# EAGLE design PIC 16F877A Board_V4 (SMD) (EAGLE 9.6.2)
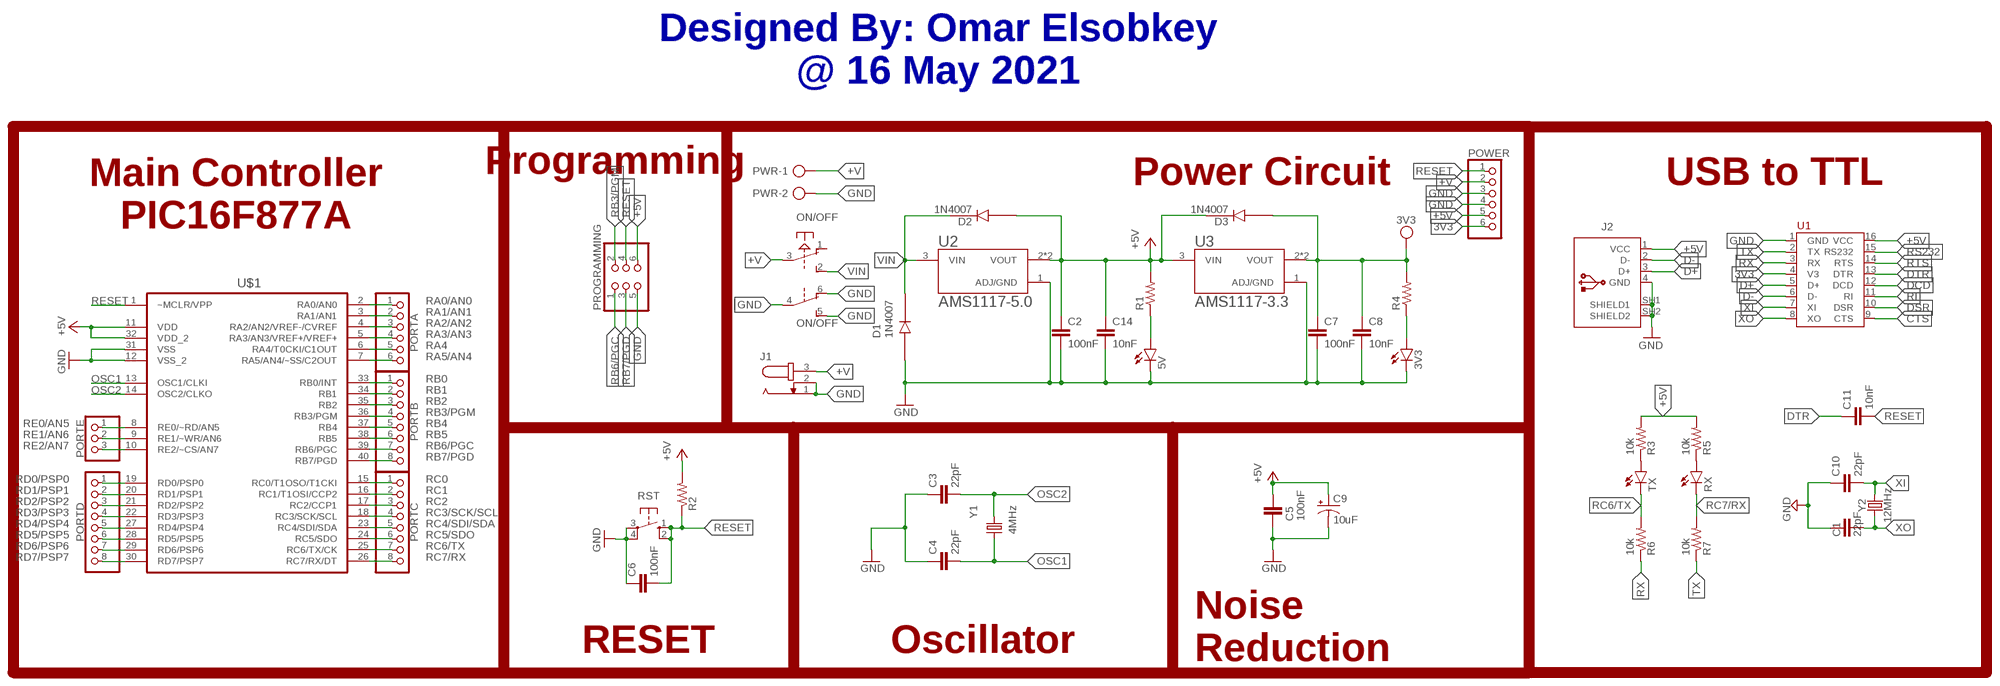
[diagram p0: schematic, sheet 1]

## Parts
3V3  LEDSML0805  [SML0805]
5V  LEDSML0805  [SML0805]
C1  22pF  C_CHIP-0805(2012-METRIC)  [CAPC2012X110]
C2  100nF  C_CHIP-0805(2012-METRIC)  [CAPC2012X110]
C3  22pF  C_CHIP-0805(2012-METRIC)  [CAPC2012X110]
C4  22pF  C_CHIP-0805(2012-METRIC)  [CAPC2012X110]
C5  100nF  C_CHIP-0805(2012-METRIC)  [CAPC2012X110]
C6  100nF  C_CHIP-0805(2012-METRIC)  [CAPC2012X110]
C7  100nF  C_CHIP-0805(2012-METRIC)  [CAPC2012X110]
C8  10nF  C_CHIP-0805(2012-METRIC)  [CAPC2012X110]
C9  10uF  10UF-POLAR-RADIAL-2.5MM-KIT-25V-20%  [CPOL-RADIAL-2.5MM-5MM-KIT]
C10  22pF  C_CHIP-0805(2012-METRIC)  [CAPC2012X110]
C11  10nF  C_CHIP-0805(2012-METRIC)  [CAPC2012X110]
C14  10nF  C_CHIP-0805(2012-METRIC)  [CAPC2012X110]
D1  1N4007  DIODE_SMD  [SMA/DO-214AC]
D2  1N4007  DIODE_SMD  [SMA/DO-214AC]
D3  1N4007  DIODE_SMD  [SMA/DO-214AC]
J1  JACK-PLUG0  [SPC4077]
J2  61729-1011  [61729-1011BLF]
ON/OFF  PVA2R  [PVA2R]
PORTA  PINHD-1X6  [1X06]
PORTB  PINHD-1X8  [1X08]
PORTC  PINHD-1X8  [1X08]
PORTD  PINHD-1X8  [1X08]
PORTE  PINHD-1X3  [1X03]
POWER  PINHD-1X6  [1X06]
PROGRAMMING  PINHD-2X3  [2X03]
PWR  AK500/2-H  [AK500/2-H]
R1  RESISTOR1206  [1206]
R2  RESISTOR1206  [1206]
R3  10k  RESISTOR1206  [1206]
R4  RESISTOR1206  [1206]
R5  10k  RESISTOR1206  [1206]
R6  10k  RESISTOR1206  [1206]
R7  10k  RESISTOR1206  [1206]
RST  10-XX  [B3F-10XX]
RX  LEDSML0805  [SML0805]
TX  LEDSML0805  [SML0805]
U1  CH340G  [SOP-16]
U2  AMS1117-5.0  [AMS1117-5.0]
U3  AMS1117-3.3  AMS1117-5.0  [AMS1117-5.0]
U$1  PIC16F877A-I/P  [PDIP-40]
Y1  4MHz  CRYSTALPTH-HC49UV  [HC49U]
Y2  12MHz  CRYSTALPTH-HC49UV  [HC49U]

## Nets
3V3: C7.1 C8.1 D3.2(A) POWER.6 R4.2 U1.4(V3) U3.2(VOUT) U3.4(VOUT)
+5V: C2.1 C5.2 C9.1(+) C14.1 D2.2(A) D3.1(C) J2.1(VCC) POWER.5 PROGRAMMING.6 R1.2 R2.2 R3.2 R5.2 U1.16(VCC) U2.2(VOUT) U2.4(VOUT) U3.3(VIN) U$1.11(VDD) U$1.32(VDD_2)
+V: J1.3 ON/OFF.3(1:P) POWER.2 PWR.1
CTS: U1.9(CTS)
D+: J2.3(D+) U1.5(D+)
D-: J2.2(D-) U1.6(D-)
DCD: U1.12(DCD)
DSR: U1.10(DSR)
DTR: C11.1 U1.13(DTR)
GND: 3V3.C 5V.C C1.1 C2.2 C3.1 C4.1 C5.1 C6.1 C7.2 C8.2 C9.2(-) C10.1 C14.2 D1.2(A) J1.1 J1.2 J2.4(GND) J2.SH1(SHIELD1) J2.SH2(SHIELD2) ON/OFF.4(2:P) ON/OFF.5(2:S) ON/OFF.6(2:O) POWER.3 POWER.4 PROGRAMMING.5 PWR.2 RST.3(P) RST.4(P1) U1.1(GND) U2.1(ADJ/GND) U3.1(ADJ/GND) U$1.12(VSS_2) U$1.31(VSS)
N$1: 3V3.A R4.1
N$2: R3.1 TX.A
N$3: R5.1 RX.A
N$4: 5V.A R1.1
OSC1: C4.2 U$1.13(OSC1/CLKI) Y1.2
OSC2: C3.2 U$1.14(OSC2/CLKO) Y1.1
RA0/AN0: PORTA.1 U$1.2(RA0/AN0)
RA1/AN1: PORTA.2 U$1.3(RA1/AN1)
RA2/AN2: PORTA.3 U$1.4(RA2/AN2/VREF-/CVREF)
RA3/AN3: PORTA.4 U$1.5(RA3/AN3/VREF+/VREF+)
RA4: PORTA.5 U$1.6(RA4/T0CKI/C1OUT)
RA5/AN4: PORTA.6 U$1.7(RA5/AN4/~SS/C2OUT)
RB0: PORTB.1 U$1.33(RB0/INT)
RB1: PORTB.2 U$1.34(RB1)
RB2: PORTB.3 U$1.35(RB2)
RB3/PGM: PORTB.4 PROGRAMMING.2 U$1.36(RB3/PGM)
RB4: PORTB.5 U$1.37(RB4)
RB5: PORTB.6 U$1.38(RB5)
RB6/PGC: PORTB.7 PROGRAMMING.1 U$1.39(RB6/PGC)
RB7/PGD: PORTB.8 PROGRAMMING.3 U$1.40(RB7/PGD)
RC0: PORTC.1 U$1.15(RC0/T1OSO/T1CKI)
RC1: PORTC.2 U$1.16(RC1/T1OSI/CCP2)
RC2: PORTC.3 U$1.17(RC2/CCP1)
RC3/SCK/SCL: PORTC.4 U$1.18(RC3/SCK/SCL)
RC4/SDI/SDA: PORTC.5 U$1.23(RC4/SDI/SDA)
RC5/SDO: PORTC.6 U$1.24(RC5/SDO)
RC6/TX: PORTC.7 R6.2 TX.C U$1.25(RC6/TX/CK)
RC7/RX: PORTC.8 R7.2 RX.C U$1.26(RC7/RX/DT)
RD0/PSP0: PORTD.1 U$1.19(RD0/PSP0)
RD1/PSP1: PORTD.2 U$1.20(RD1/PSP1)
RD2/PSP2: PORTD.3 U$1.21(RD2/PSP2)
RD3/PSP3: PORTD.4 U$1.22(RD3/PSP3)
RD4/PSP4: PORTD.5 U$1.27(RD4/PSP4)
RD5/PSP5: PORTD.6 U$1.28(RD5/PSP5)
RD6/PSP6: PORTD.7 U$1.29(RD6/PSP6)
RD7/PSP7: PORTD.8 U$1.30(RD7/PSP7)
RE0/AN5: PORTE.1 U$1.8(RE0/~RD/AN5)
RE1/AN6: PORTE.2 U$1.9(RE1/~WR/AN6)
RE2/AN7: PORTE.3 U$1.10(RE2/~CS/AN7)
RESET: C6.2 C11.2 POWER.1 PROGRAMMING.4 R2.1 RST.1(S) RST.2(S1) U$1.1(~MCLR/VPP)
RI: U1.11(RI)
RS232: U1.15(RS232)
RTS: U1.14(RTS)
RX: R6.1 U1.3(RX)
TX: R7.1 U1.2(TX)
VIN: D1.1(C) D2.1(C) ON/OFF.2(1:S) U2.3(VIN)
XI: C10.2 U1.7(XI) Y2.2
XO: C1.2 U1.8(XO) Y2.1
Unconnected: ON/OFF.1(1:O)

## Notes on the sheet
- Designed By: Omar Elsobkey
  @ 16 May 2021
- Programming | Power Circuit | USB to TTL
- Main Controller
  PIC16F877A
- RESET | Oscillator
- Noise
  Reduction

## Library data of the parts
3V3 5V RX TX = led:LED: LED OSRAM: - CHIPLED LG R971, LG N971, LY N971, LG Q971, LY Q971, LO R971, LY R971 LH N974, LH R974 LS Q976, LO Q976, LY Q976 LO Q996 - Hyper CHIPLED LW Q18S LB Q993, LB Q99A, LB R99A - SideLED LS A670, LO A670, LY A670, LG A670, LP A670 LB A673, LV A673, LT A673, LW A673 LH A674 LY A675 LS A676, LA A676, LO A676, LY A676, LW A676 LS A679, LY A679, LG A679 - Hyper Micro SIDELED® LS Y876, LA Y876, LO Y876, LY Y876 LT Y87S - SmartLED LW L88C, LW L88S LB L89C, LB L89S, LG L890 LS L89K, LO L89K, LY L89K LS L896, LA L896, LO L896, LY L896 - TOPLED LS T670, LO T670, LY T670, LG T670, LP T670 LSG T670, LSP T670, LSY T670, LOP T670, LYG T670 LG T671, LOG T671, LSG T671 LB T673, LV T673, LT T673, LW T673 LH T674 LS T676, LA T676, LO T676, LY T676, LB T676, LH T676, LSB T676, LW T676 LB T67C, LV T67C, LT T67C, LS T67K, LO T67K, LY T67K, LW E67C LS E67B, LA E67B, LO E67B, LY E67B, LB E67C, LV E67C, LT E67C LW T67C LS T679, LY T679, LG T679 LS T770, LO T770, LY T770, LG T770, LP T770 LB T773, LV T773, LT T773, LW T773 LH T774 LS E675, LA E675, LY E675, LS T675 LS T776, LA T776, LO T776, LY T776, LB T776 LHGB T686 LT T68C, LB T68C - Hyper Mini TOPLED® LB M676 - Mini TOPLED Santana® LG M470 LS M47K, LO M47K, LY M47K Source: http://www.osram.convergy.de LUXEON: - LUMILED® LXK2-PW12-R00, LXK2-PW12-S00, LXK2-PW14-U00, LXK2-PW14-V00 LXK2-PM12-R00, LXK2-PM12-S00, LXK2-PM14-U00 LXK2-PE12-Q00, LXK2-PE12-R00, LXK2-PE12-S00, LXK2-PE14-T00, LXK2-PE14-U00 LXK2-PB12-K00, LXK2-PB12-L00, LXK2-PB12-M00, LXK2-PB14-N00, LXK2-PB14-P00, LXK2-PB14-Q00 LXK2-PR12-L00, LXK2-PR12-M00, LXK2-PR14-Q00, LXK2-PR14-R00 LXK2-PD12-Q00, LXK2-PD12-R00, LXK2-PD12-S00 LXK2-PH12-R00, LXK2-PH12-S00 LXK2-PL12-P00, LXK2-PL12-Q00, LXK2-PL12-R00 Source: www.luxeon.com KINGBRIGHT: KA-3528ASYC Source: www.kingbright.com
C1-C8 C10 C11 C14 = Capacitor:C: Capacitor - Generic; CATEGORY: Capacitor
C9 = SparkFun-Capacitors:10UF-POLAR: 10.0µF polarized capacitors A capacitor is a passive two-terminal electrical component used to store electrical energy temporarily in an electric field.; PROD_ID: CAP-08440
D1-D3 = Diode SMD:DIODE_SMD: Rectifier Diode Switching 50V 1A 2-Pin DO-214AC T/R Rectifier Diode Switching 50V 1A 2-Pin DO-214AC T/R Check prices <https://pricing.snapeda.com/parts/S1A/NKK%20Switches/view-part?ref=eda>; AVAILABILITY: In Stock; DESCRIPTION: SMD Diodo Rectificador 1A 50V S1A SMD DO-214AC/SMA DIOTEC; MF: NKK Switches; MP: S1A; PACKAGE: DO-214 Diotec; PRICE: None
J1 = con-jack:JACK-PLUG: DC POWER JACK Power Jack, DC, Right Angle, Through Hole, Rated 5A at 16VDC, PC Terminals Distributor: Farnell (www.Farnell.de) Drawing: 84N1161.pdf / 84N1162.pdf Manufacturer: SPC Technology (www.spctechnology.com) Type: SPC4077 / SPC 4078; OC_FARNELL: unknown; OC_NEWARK: unknown
J2 = Connector_USB:61729-1011: USB(2.0) Type-B, RCPT, 4POS, THT-R/A Datasheet <https://www.amphenol-icc.com/media/wysiwyg/files/drawing/61729.pdf>; CATEGORY: Connector; CONTACTS: 4; CURRENT_RATING: 1A; DESCRIPTION: CONN RCPT USB2.0 TYPEB 4POS R/A; GENDER: Receptacle; MANUFACTURER: Amphenol ICC (FCI); MOUNT_TYPE: R/A; MPN: 61729-1011BLF; OPERATING_TEMP: -55°C to 85°C; PART_STATUS: Active; ROHS_COMPLIANT: RoHS Compliant; SERIES: 61729; SUB-CATEGORY: USB; TYPE: USB-B
ON/OFF = switch-misc:PVA2R: ITT SWITCH
PORTA POWER = pinhead:PINHD-1X6: PIN HEADER
PORTB PORTC PORTD = pinhead:PINHD-1X8: PIN HEADER
PORTE = pinhead:PINHD-1X3: PIN HEADER
PROGRAMMING = pinhead:PINHD-2X3: PIN HEADER
PWR = con-ptr500:AK500/2-H: CONNECTOR Aug. 2004 / PTR Meßtechnik: Die Bezeichnung der Serie AK505 wurde geändert. Es handelt sich hierbei um AK500 in horizontaler Ausführung.; OC_FARNELL: unknown; OC_NEWARK: unknown
R1-R7 = SparkFun-Resistors:RESISTOR: Generic Resistor Package
RST = switch-omron:10-XX: OMRON SWITCH; MPN: B3F-1000; OC_FARNELL: 176432; OC_NEWARK: 36M3542
U1 = CH340G:CH340G
U2 U3 = AMS1117-5.0:AMS1117-5.0: Sot223/Pkg 1-Amp 5-Volt Low Drop Out Voltage Regulatator; AVAILABILITY: Unavailable; DESCRIPTION: Sot223/Pkg 1-Amp 5-Volt Low Drop Out Voltage Regulatator; MF: Advanced Monolithic Systems; MP: AMS1117-5.0; PACKAGE: None; PRICE: None
U$1 = PIC:PIC16F877A-I/P: 8-Bit CMOS FLASH Microcontrollers Check prices <https://pricing.snapeda.com/parts/PIC16F877A-I/P/Microchip/view-part?ref=eda>; AVAILABILITY: Good; DESCRIPTION: PIC PIC® 16F Microcontroller IC 8-Bit 20MHz 14KB (8K x 14) FLASH 44-TQFP (10x10); MF: Microchip; MP: PIC16F877A-I/P; PACKAGE: DIP-40 Microchip; PRICE: None; PURCHASE-URL: https://pricing.snapeda.com/search/part/PIC16F877A-I/P/?ref=eda
Y1 Y2 = SparkFun-Clocks:CRYSTAL: Crystals (Generic) These are passive quartz crystals, which can be used as a clock source for a microcontroller. Crystal's are two-terminal devices. They require external "load" capacitors to generate an oscillating signal.

## Board
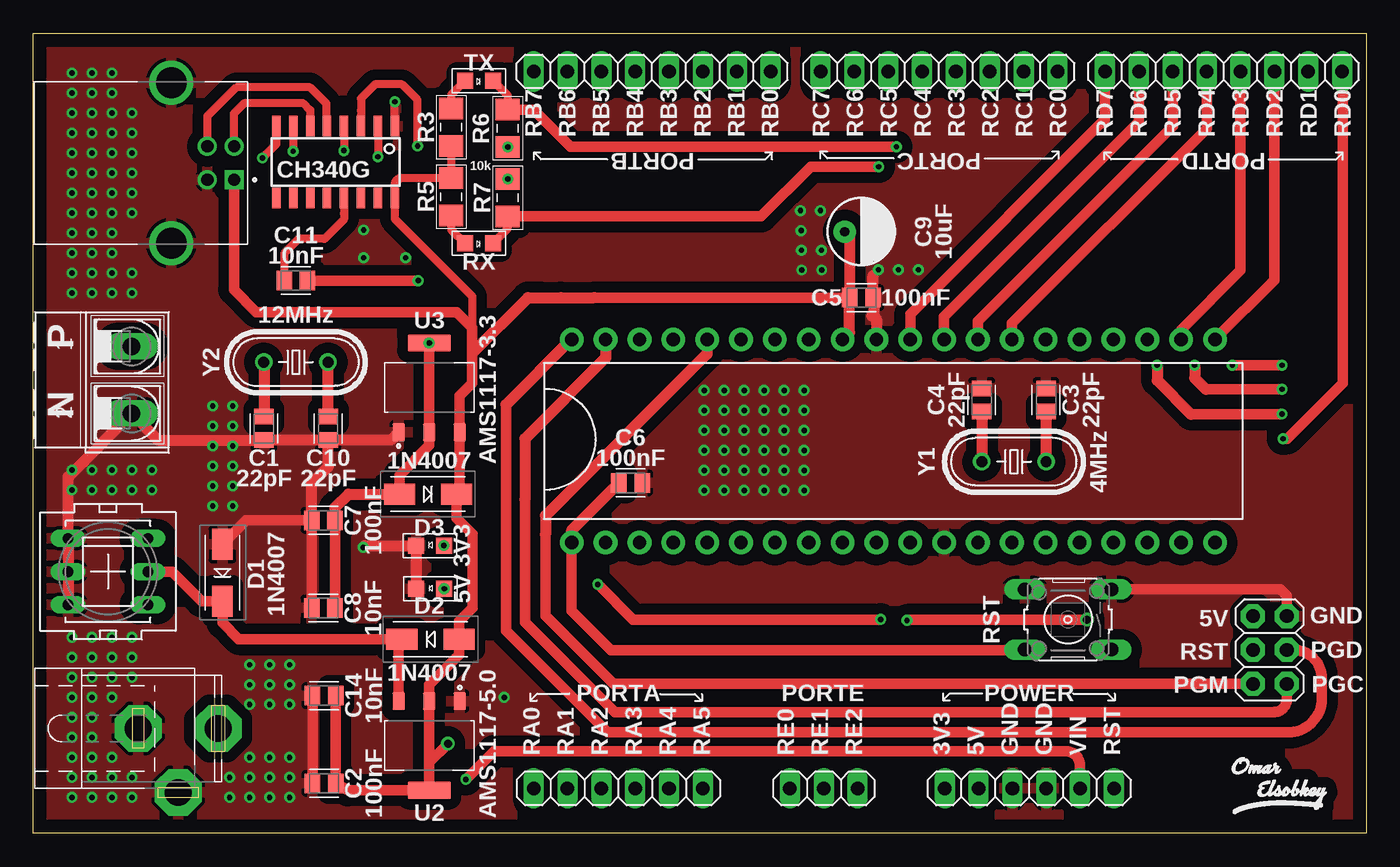
[diagram p1: board, top side]
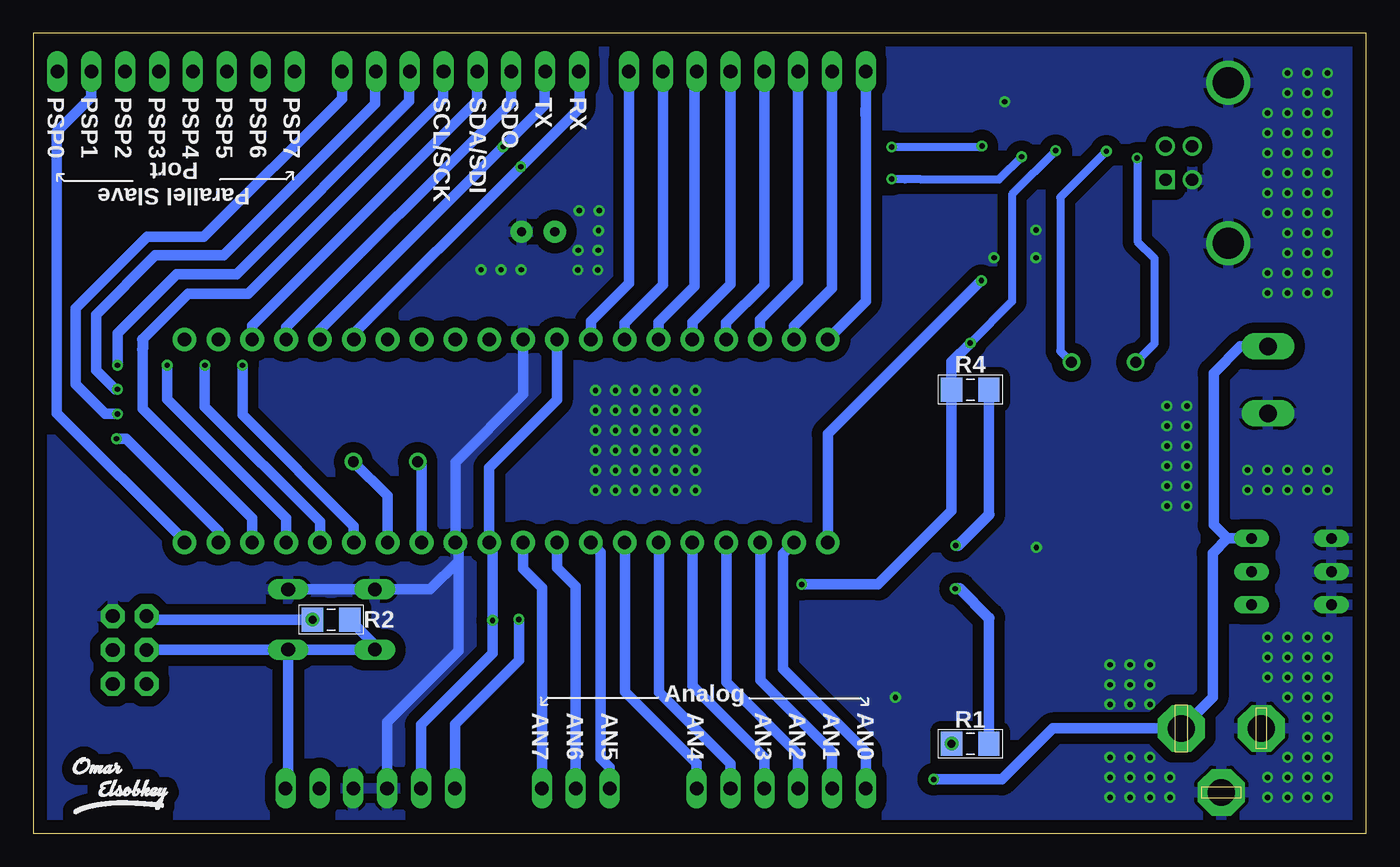
[diagram p2: board, bottom side, seen from below]

Size 100 x 60 mm. Coordinates in mm from the lower left corner, seen from the top.
Outline: 0,60 100,60 100,0 0,0 0,60
Copper layers (1*16): Top 0.035mm / dielectric 1.5mm / Bottom 0.035mm
Design rules "default *": minimum track width 0.6mm, minimum drill 0.4mm, track to track 0.6mm, track to pad 0.6mm, pad to pad 0.4mm, via to via 0.6mm, smd to smd 0.6mm, copper to edge 40mil, drill to drill 6mil, minimum pad ring 10mil, minimum via ring 8mil, stop-mask expansion 4mil, vias tented up to drill 0mil, thermal gap 10mil

### Footprints (pad centres in the part's own frame; a part is rotated, then mirrored left to right if it is on the bottom)
SML0805 = smd 1.2 x 1.2: A 1.05,0; C -1.05,0
CAPC2012X110 = smd 1.165 x 1.465: 1 -0.875,0; 2 0.875,0
CPOL-RADIAL-2.5MM-5MM-KIT = drill 0.7 pad 1.651: 1 1.25,0; 2 -1.25,0
SMA/DO-214AC = smd 2.33 x 1.56: 1 -2.14,0; 2 2.14,0
SPC4077 = drill 2 pad 3.5 octagon: 1 -3,0; 2 0,-4.8; 3 3,0
61729-1011BLF = drill 0.92 square: 1 1.25,4.71 | drill 0.92: 2 -1.25,4.71; 3 -1.25,2.71; 4 1.25,2.71 | drill 2.3: SH1 -6.02,0; SH2 6.02,0
PVA2R = drill 0.813 long: 1 -2.997,2.489; 2 -2.997,0; 3 -2.997,-2.489; 4 2.997,2.489; 5 2.997,0; 6 2.997,-2.489
1X06 = drill 1.016 long: 1 -6.35,0; 2 -3.81,0; 3 -1.27,0; 4 1.27,0; 5 3.81,0; 6 6.35,0
1X08 = drill 1.016 long: 1 -8.89,0; 2 -6.35,0; 3 -3.81,0; 4 -1.27,0; 5 1.27,0; 6 3.81,0; 7 6.35,0; 8 8.89,0
1X03 = drill 1.016 long: 1 -2.54,0; 2 0,0; 3 2.54,0
2X03 = drill 1.016 pad 1.8 octagon: 1 -2.54,-1.27; 2 -2.54,1.27; 3 0,-1.27; 4 0,1.27; 5 2.54,-1.27; 6 2.54,1.27
AK500/2-H = drill 1.321 long: 1 -2.515,0; 2 2.515,0
1206 = smd 1.6 x 1.8: 1 -1.4,0; 2 1.4,0
B3F-10XX = drill 1.016 long: 1 -3.251,2.261; 2 3.251,2.261; 3 -3.251,-2.261; 4 3.251,-2.261
SOP-16 = smd 0.635 x 1.524: 1 -4.445,-2.695; 2 -3.175,-2.695; 3 -1.905,-2.695; 4 -0.635,-2.695; 5 0.635,-2.695; 6 1.905,-2.695; 7 3.175,-2.695; 8 4.445,-2.695; 9 4.445,2.695; 10 3.175,2.695; 11 1.905,2.695; 12 0.635,2.695; 13 -0.635,2.695; 14 -1.905,2.695; 15 -3.175,2.695; 16 -4.445,2.695
AMS1117-5.0 = smd 0.93 x 1.31: 1 -2.29,-3.345; 2 0,-3.345; 3 2.29,-3.345 | smd 3.24 x 1.31: 4 0,3.345
PDIP-40 = drill 0.991 pad 1.778: 1 -7.62,24.13; 2 -7.62,21.59; 3 -7.62,19.05; 4 -7.62,16.51; 5 -7.62,13.97; 6 -7.62,11.43; 7 -7.62,8.89; 8 -7.62,6.35; 9 -7.62,3.81; 10 -7.62,1.27; 11 -7.62,-1.27; 12 -7.62,-3.81; 13 -7.62,-6.35; 14 -7.62,-8.89; 15 -7.62,-11.43; 16 -7.62,-13.97; 17 -7.62,-16.51; 18 -7.62,-19.05; 19 -7.62,-21.59; 20 -7.62,-24.13; 21 7.62,-24.13; 22 7.62,-21.59; 23 7.62,-19.05; 24 7.62,-16.51; 25 7.62,-13.97; 26 7.62,-11.43; 27 7.62,-8.89; 28 7.62,-6.35; 29 7.62,-3.81; 30 7.62,-1.27; 31 7.62,1.27; 32 7.62,3.81; 33 7.62,6.35; 34 7.62,8.89; 35 7.62,11.43; 36 7.62,13.97; 37 7.62,16.51; 38 7.62,19.05; 39 7.62,21.59; 40 7.62,24.13
HC49U = drill 0.813: 1 -2.413,0; 2 2.413,0

### Placement (x,y rotation side)
3V3  29.75,21.58 0 top
5V  29.78,18.35 0 top
C1  17.3,30.37 90 top
C2  21.81,3.75 180 top
C3  75.97,32.5 270 top
C4  71.15,32.5 270 top
C5  62.12,40.17 180 top
C6  44.8,26.28 180 top
C7  21.76,23.48 180 top
C8  21.76,16.9 180 top
C9  62.12,45.12 180 top
C10  22.12,30.37 90 top
C11  19.7,41.46 0 top
C14  21.81,10.33 180 top
D1  14.19,19.54 90 top
D2  29.79,14.56 0 top
D3  29.61,25.44 180 top
J1  10.87,7.88 0 top
J2  10.35,50.27 270 top
ON/OFF  5.6,19.62 180 top
PORTA  43.88,3.38 0 top
PORTB  46.42,57.14 180 top
PORTC  67.95,57.14 180 top
PORTD  89.3,57.14 180 top
PORTE  59.3,3.38 0 top
POWER  74.72,3.38 180 top
PROGRAMMING  92.78,13.76 90 top
PWR  7.37,34 270 top
R1  29.7,6.72 180 bottom
R2  77.66,16.03 180 bottom
R3  31.36,52.95 270 top
R4  29.7,33.28 180 bottom
R5  31.36,47.75 90 top
R6  35.59,52.88 90 top
R7  35.59,47.67 270 top
RST  77.63,16.03 180 top
RX  33.43,44.24 180 top
TX  33.43,56.43 180 top
U1  22.68,50.35 180 top
U2  29.7,6.58 180 top
U3  29.7,33.42 0 top
U$1  64.53,29.43 90 top
U$2  [OMAR_ELSOBKEY_X0.5_T]  93.82,3.39 0 bottom
U$3  [OMAR_ELSOBKEY_X0.5_TN]  93.13,3.39 0 top
U$4  [OMAR_ELSOBKEY_X0.5_T]  93.13,3.39 0 top
U$5  [OMAR_ELSOBKEY_X0.5_TN]  93.82,3.39 0 bottom
Y1  73.58,27.87 180 top
Y2  19.7,35.34 0 top

### Tracks (layer width: path | path; a pad name or v marks a point on that pad's centre or on a via)
3V3  (via drill 0.4)
  Top 0.6: U1.4 v23.31,51.21 arc-90 v23.3,51.2
  Top 0.8: C8.1 C7.1 | D3.2 27.47,26.87 29.7,29.1 U3.2 U3.4 | v42.36,18.68 45.01,16.02 63.55,16.02 v63.58,16.05
  Top 0.813: C7.1 22.64,24.44 23.64,25.44 D3.2
  Bottom 0.6: v23.3,51.2 26.57,47.92 26.57,39.9 U3.4
  Bottom 0.8: U3.4 31.1,35.37 R4.2 31.1,24.2 36.62,18.68 v42.36,18.68 | v63.58,16.05 63.58,12.97 68.38,8.18 POWER.6
  other vias: 29.7,36.77
+5V  (via drill 0.4, 0.6)
  Top 0.6: 32.93,37.45 32.93,40.27 27.12,46.09 U1.16 27.12,48.65 arc-90 27.62,49.15 R5.2 R3.2
  Top 0.8: C5.2 42.08,40.18 | R2.2 79.03,16 65.55,16 v65.55,15.97 | 29.7,5.32 U2.4 23.61,3.23 C2.1 C14.1 | 29.7,5.32 U2.2 29.7,11.15 31.93,13.38 D2.2 31.93,15.9 32.95,16.93 32.95,22.43 31.75,23.62 D3.1 31.99,25.68 U3.3 31.99,32.81 32.93,33.75 32.93,36 32.93,37.45 32.93,37.92 31.75,39.1 16.73,39.1 15.06,40.77 J2.1 | 29.7,5.32 R1.2 | 38.07,40.18 39.58,40.18
  Top 0.813: 42.08,40.18 39.58,40.18 37.11,40.18 32.93,36 | C9.1 61.25,44.75 C5.2 61.25,37.58 U$1.32
  Bottom 0.8: POWER.5 70.92,8.13 65.55,13.51 v65.55,15.97 65.55,21.55 U$1.11 65.8,27.43 60.72,32.51 U$1.32 | PROGRAMMING.6 91.23,16.02 79.37,16.02 79.36,16.03 R2.2
  other vias: 79.06,16.03 31.1,6.72
+V  (via drill 0.4)
  Top 0.8: v32.45,4.05 34.57,6.17 77.43,6.17 arc-90 78.53,5.07 POWER.2
  Bottom 0.8: PWR.1 9.43,36.52 11.45,34.5 11.45,23.13 10.44,22.11 | 10.44,22.11 ON/OFF.3 | 10.44,22.11 11.53,21.02 11.53,10.22 J1.3 23.52,7.88 27.35,4.05 v32.45,4.05
D+
  Top 0.6: U1.5 21.99,53.09 21.99,54.73 20.76,55.95 15.22,55.95 13.06,53.79 J2.3
D-
  Top 0.6: U1.6 20.77,54.24 20.27,54.75 15.81,54.75 15.06,53.99 J2.2
DTR
  Top 0.6: U1.13 23.31,46.48
  Top 0.61: U1.13 23.31,46.04 21.85,44.58 19.9,44.58 18.82,43.5 C11.1
GND  (via drill 0.4)
  Top 0.6: U1.1 v27.12,54.87 v27.12,54.88
  Top 0.8: 63.42,45.08 C9.2 | RST.3 93.55,18.3 94.05,17.8 PROGRAMMING.5 | D1.2 15.98,23.48 C7.2 C8.2 | C2.2 C14.2
  Top 0.813: C10.1 C1.1 9.37,29.5 PWR.2 2.6,26.72 ON/OFF.6 ON/OFF.5 ON/OFF.4 | U3.1 26.83,29.5 C10.1 | C7.2 20.89,26.26 22.12,27.5 C10.1 | v24.75,21.45 24.88,21.58 3V3.C 28.7,18.37 5V.C | 63.05,38.8 63.05,40.12 C5.1 63,41.83 | 62.9,38.8 63.05,38.8 | 63,41.83 | 63.05,38.8 63.26,38.59 U$1.31
  Bottom 0.8: 68.08,20.43 68.08,21.55 U$1.12 68.33,27.84 63.26,32.92 U$1.31 | 68.08,20.43 68.08,13.69 73.45,8.32 POWER.4 | 68.08,20.43 70.22,18.29 RST.4 RST.3
  other vias: 35.33,10.2 24.77,43.17 24.77,45.25 27.93,43.17 50.33,33.23 2.9,27.25 2.9,2.7 2.9,57.02 13.45,32.05 14.95,32.05 16.23,12.65 63.4,42.27 64.9,42.27 66.4,42.27 4.4,57.02 5.9,57.02 2.9,55.52 2.9,54.02 2.9,52.52 2.9,51.02 2.9,49.52 2.9,48.02 2.9,46.52 2.9,45.02 2.9,43.52 2.9,42.02 2.9,40.52 57.55,46.7 59.05,46.7 57.6,45.2 57.62,43.73 59.12,43.73 57.65,42.25 59.15,42.25 4.4,55.52 4.4,54.02 4.4,52.52 4.4,51.02 4.4,49.52 4.4,48.02 4.4,46.52 4.4,45.02 4.4,43.52 4.4,42.02 4.4,40.52 5.9,55.52 5.9,54.02 5.9,52.52 5.9,51.02 5.9,49.52 5.9,48.02 5.9,46.52 5.9,45.02 5.9,43.52 5.9,42.02 5.9,40.52 7.4,54.02 7.4,52.52 7.4,51.02 7.4,49.52 7.4,48.02 7.4,46.52 7.4,42.02 7.4,40.52 4.4,27.25 5.9,27.25 7.4,27.25 8.9,27.25 2.9,25.75 4.4,25.75 5.9,25.75 7.4,25.75 8.9,25.75 13.45,30.55 13.45,29.05 13.45,27.55 13.45,26.05 13.45,24.55 14.95,30.55 14.95,29.05 14.95,27.55 14.95,26.05 14.95,24.55 16.23,11.15 17.73,12.65 19.23,12.65 17.73,11.15 19.23,11.15 16.23,9.68 17.73,9.68 19.23,9.68 4.4,2.7 5.9,2.7 7.4,2.7 2.9,4.2 2.9,5.7 2.9,7.2 2.9,8.7 2.9,10.2 2.9,11.7 2.9,13.2 2.9,14.7 4.4,4.2 4.4,5.7 4.4,7.2 4.4,8.7 4.4,10.2 4.4,11.7 4.4,13.2 4.4,14.7 5.9,4.2 5.9,5.7 5.9,10.2 5.9,11.7 5.9,13.2 5.9,14.7 7.4,4.2 7.4,11.7 7.4,13.2 7.4,14.7 14.72,2.7 16.23,2.7 17.73,2.7 19.23,2.7 14.72,4.2 16.23,4.2 17.73,4.2 19.23,4.2 16.23,5.7 17.73,5.7 19.23,5.7 51.83,33.23 53.33,33.23 54.83,33.23 56.33,33.23 57.83,33.23 50.33,31.73 50.33,30.23 50.33,28.73 50.33,27.23 50.33,25.73 51.83,31.73 51.83,30.23 51.83,28.73 51.83,27.23 51.83,25.73 53.33,31.73 53.33,30.23 53.33,28.73 53.33,27.23 53.33,25.73 54.83,31.73 54.83,30.23 54.83,28.73 54.83,27.23 54.83,25.73 56.33,31.73 56.33,30.23 56.33,28.73 56.33,27.23 56.33,25.73 57.83,31.73 57.83,30.23 57.83,28.73 57.83,27.23 57.83,25.73
  pour Top (isolate 0.8): -4.65,61.65 104.45,61.65 104.45,-2.12 -4.62,-2.12 -4.65,-2.12
  pour Bottom (isolate 0.8): -8.15,63.88 107.2,63.88 107.2,-5 -8.15,-5
N$1  (via drill 0.4)
  Bottom 0.8: R4.1 28.3,23.9
  Bottom 0.813: 28.3,23.9 30.62,21.58 3V3.A
  other vias: 30.8,21.58
N$2
  Top 0.6: TX.A 31.36,55.41 R3.1
N$3
  Top 0.6: R5.1 31.36,45.26 RX.A
N$4  (via drill 0.4)
  Bottom 0.8: R1.1 28.3,16.15
  Bottom 0.813: 28.3,16.15 30.5,18.35 5V.A
  other vias: 30.83,18.35
OSC1
  Top 0.813: C4.2 71.16,31.61 Y1.2
  Bottom 0.8: U$1.13 70.88,27.59 Y1.2
OSC2
  Top 0.813: C3.2 75.97,27.89 Y1.1
  Bottom 0.8: U$1.14 73.42,25.3 Y1.1
RA0/AN0
  Bottom 0.8: U$1.2 43.76,20.98 43.76,12.36 37.53,6.13 PORTA.1
RA1/AN1
  Bottom 0.8: PORTA.2 40.08,6.12 45.45,11.5 45.45,21.78 U$1.3
RA2/AN2
  Bottom 0.8: U$1.4 47.99,21.78 47.99,11.31 42.62,5.94 PORTA.3
RA3/AN3
  Bottom 0.8: PORTA.4 45.16,5.66 50.55,11.05 U$1.5
RA4
  Bottom 0.8: U$1.6 53.07,21.78 53.07,10.6 47.7,5.22 PORTA.5
RA5/AN4
  Bottom 0.8: U$1.7 55.61,21.78 55.61,10.62 50.23,5.25 PORTA.6
RB0
  Bottom 0.8: PORTB.1 55.31,41.26 58.17,38.4 U$1.33
RB1
  Bottom 0.8: PORTB.2 52.77,41.13 55.63,38.27 U$1.34
RB2
  Bottom 0.8: PORTB.3 50.4,56.98 50.4,41.05 53.09,38.34 U$1.35
RB3/PGM
  Top 0.8: 38.42,22.4 38.42,16.32 43.52,11.22 91.5,11.22 PROGRAMMING.2
  Top 0.813: U$1.36 50.55,35.95 38.42,23.82 38.42,22.4
  Bottom 0.8: PORTB.4 47.7,41.18 50.55,38.32 U$1.36
RB4
  Bottom 0.8: PORTB.5 45.16,41.16 48.02,38.3 U$1.37
RB5
  Bottom 0.8: PORTB.6 42.62,41.38 45.48,38.52 U$1.38
RB6/PGC
  Top 0.8: 36.89,25.02 36.89,15.84 43.62,9.1 93.1,9.1 arc90 94.05,10.04 PROGRAMMING.1
  Top 0.813: U$1.39 42.94,35.66 36.89,29.61 36.89,25.02
  Bottom 0.8: PORTB.7 40.08,40.9 42.94,38.04 U$1.39
RB7/PGD
  Top 0.8: PROGRAMMING.3 94.54,13.76 arc-90 96.67,11.62 96.67,10.11 arc-90 94.14,7.57 43.08,7.57 35.45,15.2 35.45,32.16
  Top 0.813: U$1.40 40.34,37.05 35.45,32.16
  Bottom 0.8: PORTB.8 37.4,57 | 37.57,54.3 37.57,53.9 37.53,53.94 PORTB.8 | PORTB.8 37.53,39.91 U$1.40
RC0  (via drill 0.4)
  Top 0.8: v93.69,31.45 93.66,31.43 86.85,31.43
  Top 0.813: v84.31,35.11 84.31,33.97 86.85,31.43
  Bottom 0.8: U$1.15 75.95,23.04 84.31,31.4 v84.31,35.11 | PORTC.1 76.84,55.11 87.2,44.75 91.44,44.75 96.83,39.37 96.83,33.67 94.6,31.45 v93.69,31.45
RC1  (via drill 0.4)
  Top 0.8: 87.97,33.3 v93.69,33.3 | v93.69,33.3 arc90 v93.69,33.3
  Top 0.813: v87.13,35.11 87.13,34.14 87.97,33.3
  Bottom 0.8: U$1.16 78.5,23.38 87.13,32.01 v87.13,35.11 | PORTC.2 74.37,57.07 74.37,54.71 85.72,43.35 90.86,43.35 95.3,38.91 95.3,34.74 93.86,33.3 v93.69,33.3
RC2  (via drill 0.4)
  Top 0.8: v89.95,35.11 89.96,35.1 93.67,35.1 v93.69,35.11
  Bottom 0.8: 81,21.84 U$1.17 81.03,23.64 89.95,32.55 v89.95,35.11 | v93.69,35.11 93.69,37.52 89.26,41.95 84.75,41.95 71.8,54.9 71.8,57.1 PORTC.3
RC3/SCK/SCL
  Bottom 0.8: U$1.18 83.58,23.62 91.8,31.85 91.8,36.3 | PORTC.4 69.24,57.12 69.24,55.11 83.88,40.48 88.38,40.48 91.8,37.05
  Bottom 0.813: 91.8,37.05 91.8,36.3
RC4/SDI/SDA
  Bottom 0.8: U$1.23 83.58,38.08 66.69,54.96 66.69,57.13 PORTC.5
RC5/SDO
  Bottom 0.8: U$1.24 81.03,37.94 64.16,54.81 64.16,57.11 PORTC.6
RC6/TX  (via drill 0.4)
  Top 0.6: TX.C 34.5,56.43 35.59,55.35 R6.2 35.66,54.35
  Top 0.8: R6.2 37.52,54.28 40.3,51.5 v64.75,51.5
  Bottom 0.8: U$1.25 78.5,37.76 v64.75,51.5 61.63,54.62 61.63,57.11 PORTC.7
RC7/RX  (via drill 0.4)
  Top 0.6: RX.C 35.59,45.35 R7.2
  Top 0.8: R7.2 54.6,46.27 58.33,50 v63.42,50
  Bottom 0.8: U$1.26 75.95,37.47 v63.42,50 59.03,54.39 59.03,57.11 PORTC.8
RD0/PSP0  (via drill 0.4)
  Top 0.8: v93.76,29.6 94.09,29.6 98.24,33.75 98.24,57.09 PORTD.1
  Bottom 0.8: U$1.19 86.09,21.83 86.09,22.66 93.03,29.6 v93.76,29.6
RD1/PSP1
  Bottom 0.8: PORTD.2 95.65,55.21 98.25,52.61 98.25,31.52 88.66,21.93 U$1.20
RD2/PSP2
  Top 0.8: U$1.21 93.11,41.5 PORTD.3
  Bottom 0.8: U$1.21 88.75,37.05
RD3/PSP3
  Top 0.8: U$1.22 86.11,37.77 90.57,42.22 PORTD.4
  Bottom 0.8: U$1.22 86.11,37.29
RD4/PSP4
  Top 0.8: U$1.27 73.42,38.24 88.03,52.85 PORTD.5
RD5/PSP5
  Top 0.8: PORTD.6 85.49,53.04 70.88,38.42 U$1.28
RD6/PSP6
  Top 0.8: U$1.29 68.33,38.73 82.95,53.35 PORTD.7
RD7/PSP7
  Top 0.8: U$1.30 65.8,38.95 80.41,53.56 PORTD.8
RE0/AN5
  Bottom 0.8: U$1.8 57.44,21.07 57.44,5.65 56.77,4.97 PORTE.1
RE1/AN6
  Bottom 0.8: U$1.9 60.72,19.93 59.3,18.52 PORTE.2
RE2/AN7
  Bottom 0.8: U$1.10 63.26,19.83 61.84,18.42 PORTE.3
RESET  (via drill 0.4)
  Top 0.8: U$1.1 40.4,16.7 43.35,13.75 74.36,13.75 RST.2 | C11.2 28.86,41.46 v28.88,41.45
  Top 0.813: U$1.1 40.4,22.75 C6.2
  Bottom 0.8: RST.2 RST.1 | 74.7,13.77 RST.2 | RST.1 80.89,13.76 PROGRAMMING.4 | 40.4,23.09 U$1.1 40.4,29.95 28.9,41.45 v28.88,41.45 | RST.1 80.88,3.57 POWER.1 | RST.2 74.38,14.15 R2.1
RX  (via drill 0.4)
  Top 0.6: v28.82,51.55 28.82,55.02 27.66,56.18 25.63,56.18 24.58,55.13 24.58,54.22 24.58,53.85 U1.3
  Bottom 0.6: v28.82,51.55 28.92,51.45 35.57,51.45 R6.1
  other vias: 35.59,51.48
TX  (via drill 0.4)
  Top 0.6: U1.2 v25.85,50.75
  Bottom 0.6: v25.85,50.75 27.55,49.05 33,49.05 33.4,49.05 34.59,49.05 35.57,49.05 v35.59,49.08
VIN
  Top 0.8: ON/OFF.2 10.4,19.62 12.63,17.4 D1.1 14.19,15.79 15.42,14.56 D2.1 27.41,14.32 U2.3
XI  (via drill 0.4)
  Top 0.6: 19.52,53.07 U1.7 v19.5,51.16 v19.49,51.16
  Top 0.61: 22.12,35.33 Y2.2
  Top 0.813: C10.2 22.12,35.33
  Bottom 0.6: Y2.2 22.95,36.17 22.95,47.7 v19.49,51.16
XO  (via drill 0.4 pad 0.4)
  Top 0.6: 18.28,53.09 U1.8 18.23,51.69 v17.18,50.64
  Top 0.813: Y2.1 17.3,35.32 C1.2
  Bottom 0.6: v17.18,50.64 17.15,50.62 17.15,44.38 15.88,43.1 15.88,36.75 Y2.1

### Text on the board
tNames: RB7 | RB6 | RB5 | RB4 | RB3 | RB2 | RB1 | RB0 | RC7 | RC6 | RC5 | RC4 | RC3 | RC2 | RC1 | RC0 | RD7 | RD6 | RD5 | RD4 | RD3 | RD2 | RD1 | RD0 | P | N | 5V | GND | RST | PGD | PGM | PGC | RA0 | RA1 | RA2 | RA3 | RA4 | RA5 | RE0 | RE1 | RE2 | 3V3 | 5V | GND | GND | VIN | RST
bNames: RX | TX | SDO | SDA/SDI | SCL/SCK | PSP7 | PSP6 | PSP5 | PSP4 | PSP3 | PSP2 | PSP1 | PSP0 | Parallel Slave / Port | Analog | AN0 | AN1 | AN2 | AN3 | AN4 | AN5 | AN6 | AN7